# EasyEDA Pro project busmaster-v101.eprj, board bus-board
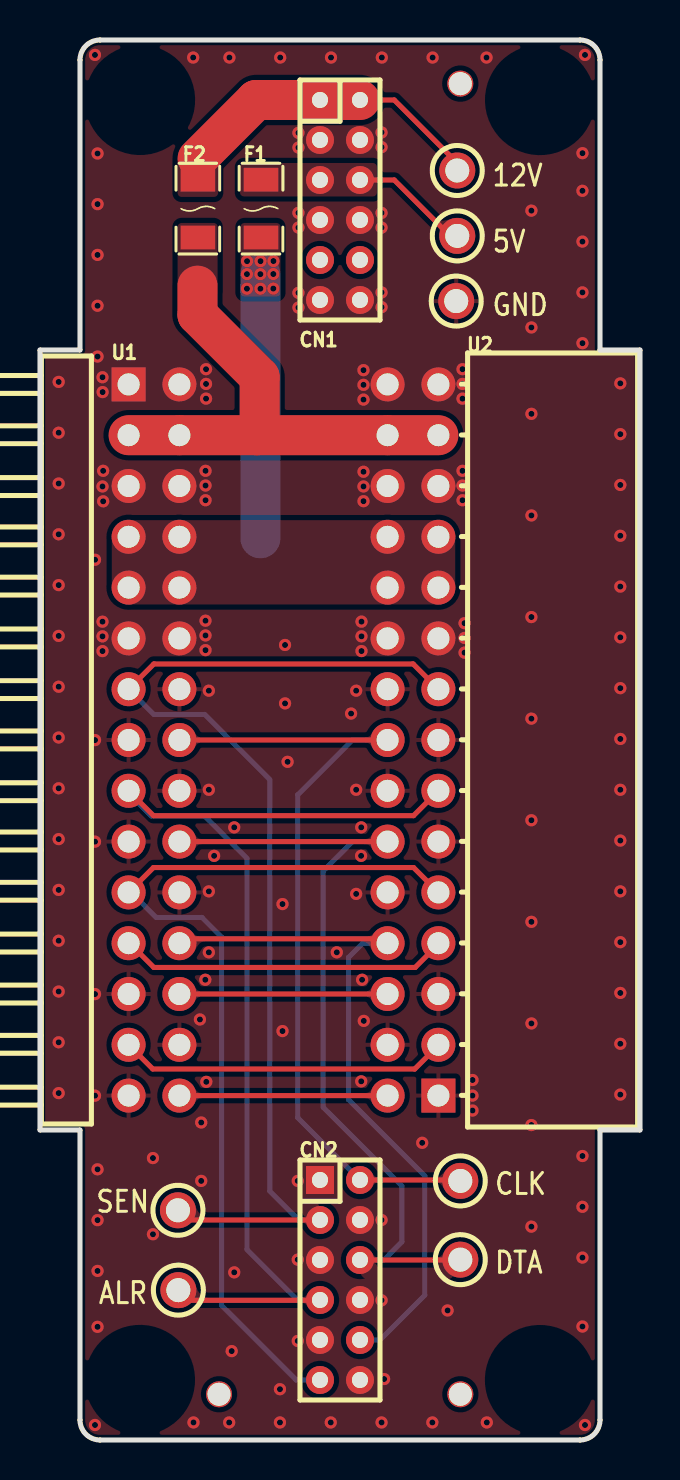
[diagram p8: board, top side]
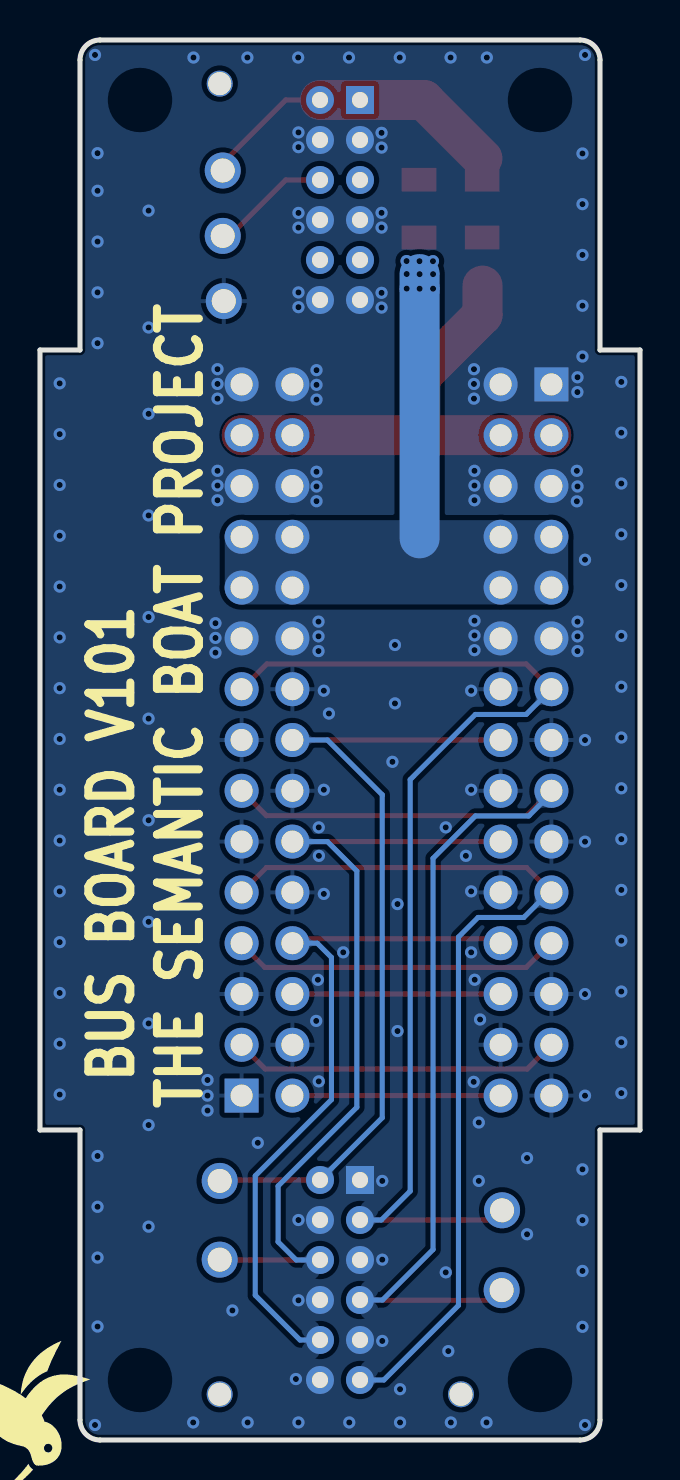
[diagram p9: board, bottom side, seen from below]

Outline 30 x 70 mm; copper layers: Top Layer, Inner1, Inner2, Bottom Layer. Coordinates in mm from the lower left corner of the outline.
Outline path: 0,54.5 2,54.5 2,69 arc(2.29,69.71) 3,70 27,70 arc(27.71,69.71) 28,69 28,54.5 30,54.5 30,15.5 28,15.5 28,1 arc(27.71,0.29) 27,0 3,0 arc(2.29,0.29) 2,1 2,15.5 0,15.5 0,54.5
Stack: Top Layer 0.035mm Outer layer thickness 1oz / Dielectric1 0.2104mm 7628 RC49% 8.6mil / Inner1 0.0152mm Inner layer thickness / Dielectric2 1.065mm 1.1mm H/HOZ Copper / Inner2 0.0152mm Inner layer thickness / Dielectric3 0.2104mm 7628 RC49% 8.6mil / Bottom Layer 0.035mm Outer layer thickness 1oz

## Design rules (mm)
net GND: power
net +5V: power
net +12V: power
template: JLCPCB Capability(Multiple Layers Board)
spacing copperThickness1oz (default): track to track 0.102, other pairs 0.152 to 0.3
spacing copperThickness2oz: track to track 0.203, other pairs 0.152 to 0.3
spacing copperThicknessInner0.5oz: track to track 0.089, other pairs 0.152 to 0.3
track width copperThickness1oz (default): min 0.102, default 0.254, max 2.54
track width copperThickness2oz: min 0.203, default 0.254, max 2.54
track width copperThickness0.5oz: min 0.089, default 0.254, max 2.54
differential pair differentialPair (default): width min 0.127, default 0.254, max 2.54; gap min 0.152, default 0.152
via viaSize (default): diameter min 0.3, default 0.61, max 10; hole min 0.2, default 0.305, max 6.3

## Placement (name value [footprint] x y rotation side)
CN1  PH2.0-01-06PZS  [HDR-TH_12P-P2.00-V-M-R2-C6-S2.00]  15 62 270 top
CN2  PH2.0-01-06PZS  [HDR-TH_12P-P2.00-V-M-R2-C6-S2.00]  15 8 270 top
F1  1206L100/30NR  [F1206]  11.05 61.57 270 top
F2  JK-nSMD050-30  [F1206]  7.89 61.57 270 top
NOREF  -  [Pad_e1]  8.95 2.29 0 top
NOREF#2  -  [Pad_e0]  21.02 2.29 0 top
NOREF#3  -  [Pad_e3]  21.01 67.82 0 top
TP0  RH-5004  [TESTPOINT_TH_BD2.5-D1.2]  20.81 56.95 90 top
TP1  RH-5004  [TESTPOINT_TH_BD2.5-D1.2]  20.86 63.47 0 top
TP2  RH-5004  [TESTPOINT_TH_BD2.5-D1.2]  20.86 60.2 0 top
TP4  RH-5004  [TESTPOINT_TH_BD2.5-D1.2]  21.01 12.95 0 top
TP5  RH-5004  [TESTPOINT_TH_BD2.5-D1.2]  21.01 9.02 0 top
TP6  RH-5004  [TESTPOINT_TH_BD2.5-D1.2]  6.92 7.49 0 top
TP7  RH-5004  [TESTPOINT_TH_BD2.5-D1.2]  6.9 11.49 0 top
U1  XDZ254-2-15-W-2.5-G1  [HDR-TH_30P-P2.54-H-M-R2-C15-S2.54-N]  5.7 35 270 top
U2  PM254-2-15-W-8.5  [HDR-TH_30P-P2.54-H-F-R2-C15-W8.5]  18.65 35 90 top

## Footprints (pads in the part's own frame, mm; a bottom-side part is the same pattern mirrored in y, then rotated)
F1206
  rect 1.19x1.728 smd: 1(-1.445,0) 2(1.445,0)
HDR-TH_12P-P2.00-V-M-R2-C6-S2.00
  rect 1.4x1.4 hole 0.8: 1(-5,-1)
  round 1.4 hole 0.8: 2(-5,1) 3(-3,-1) 4(-3,1) 5(-1,-1) 6(-1,1) 7(1,-1) 8(1,1) 9(3,-1) 10(3,1) 11(5,-1) 12(5,1)
HDR-TH_30P-P2.54-H-F-R2-C15-W8.5
  rect 1.7x1.7 hole 1.1: 1(-17.78,-1.27)
  round 1.7 hole 1.1: 2(-17.78,1.27) 3(-15.24,-1.27) 4(-15.24,1.27) 5(-12.7,-1.27) 6(-12.7,1.27) 7(-10.16,-1.27) 8(-10.16,1.27) 9(-7.62,-1.27) 10(-7.62,1.27) 11(-5.08,-1.27) 12(-5.08,1.27) 13(-2.54,-1.27) 14(-2.54,1.27) 15(0,-1.27) 16(0,1.27) 17(2.54,-1.27) 18(2.54,1.27) 19(5.08,-1.27) 20(5.08,1.27) 21(7.62,-1.27) 22(7.62,1.27) 23(10.16,-1.27) 24(10.16,1.27) 25(12.7,-1.27) 26(12.7,1.27) 27(15.24,-1.27) 28(15.24,1.27) 29(17.78,-1.27) 30(17.78,1.27)
HDR-TH_30P-P2.54-H-M-R2-C15-S2.54-N
  rect 1.7x1.7 hole 1.1: 1(-17.78,-1.27)
  round 1.7 hole 1.1: 2(-17.78,1.27) 3(-15.24,-1.27) 4(-15.24,1.27) 5(-12.7,-1.27) 6(-12.7,1.27) 7(-10.16,-1.27) 8(-10.16,1.27) 9(-7.62,-1.27) 10(-7.62,1.27) 11(-5.08,-1.27) 12(-5.08,1.27) 13(-2.54,-1.27) 14(-2.54,1.27) 15(0,-1.27) 16(0,1.27) 17(2.54,-1.27) 18(2.54,1.27) 19(5.08,-1.27) 20(5.08,1.27) 21(7.62,-1.27) 22(7.62,1.27) 23(10.16,-1.27) 24(10.16,1.27) 25(12.7,-1.27) 26(12.7,1.27) 27(15.24,-1.27) 28(15.24,1.27) 29(17.78,-1.27) 30(17.78,1.27)
Pad_e0
  round 1.3 hole 1.152: 1(0,0)
Pad_e1
  round 1.3 hole 1.152: 1(0,0)
Pad_e3
  round 1.3 hole 1.152: 1(0,0)
TESTPOINT_TH_BD2.5-D1.2
  round 1.8 hole 1.2: 1(0,0)

## Nets
As in the schematic.

Pads without a net: CN1 9 10; NOREF 1; NOREF#2 1; NOREF#3 1

## Via types
v1: diameter 0.61, hole 0.305, Top Layer to Bottom Layer, 180 vias

## Routing (per net, layer and track width the routed paths; a pad name or vN(x,y) marks a point on that pad's centre or on a via; arc(x,y) is an arc through that point)
+5V: length 13.2
  Bottom Layer w2: 11.02,45.08 v1(11.02,57.56) v1(11.02,58.29)
  vias: v1(10.35,58.29) v1(10.35,57.56) v1(10.35,58.94) v1(11.03,58.94) v1(11.67,58.95) v1(11.67,58.3) v1(11.67,57.57)
+12V: length 24.3
  Top Layer w2: 10.86,50.24 U1.4 U1.3 ; 10.86,50.24 10.98,50.36 10.98,53.15 7.87,56.26 7.87,57.72 ; 10.86,50.24 U2.28 U2.27
GND:
  vias: v1(0.93,52.9) v1(0.93,50.36) v1(0.93,47.82) v1(0.93,45.28) v1(0.93,42.74) v1(0.93,40.2) v1(0.93,37.66) v1(0.93,35.12) v1(0.93,32.58) v1(0.93,30.04) v1(0.93,27.5) v1(0.93,24.96) v1(0.93,22.42) v1(0.93,19.88) v1(0.93,17.34) v1(2.75,69.25) v1(2.75,0.75) v1(2.75,44.01) v1(2.75,35) v1(2.75,29.92) v1(2.75,22.3) v1(2.75,17.22) v1(2.88,64.33) v1(2.88,61.79) v1(2.88,59.25) v1(2.88,56.71) v1(2.88,54.17) v1(2.88,13.53) v1(2.88,10.99) v1(2.88,8.45) v1(2.88,5.66) v1(3.12,53.14) v1(3.13,52.4) v1(3.12,47.68) v1(3.12,40.92) v1(3.12,40.18) v1(3.12,39.44) v1(3.16,48.46) v1(3.16,46.93) v1(5.65,14.1) v1(5.65,10.29) v1(7.66,69.12) v1(7.67,0.88) v1(8,21.03) v1(8.06,15.88) v1(8.06,12.95) v1(8.3,53.54) v1(8.3,52.8) v1(8.3,52.07) v1(8.28,48.46) v1(8.28,47.72) v1(8.28,46.99) v1(8.28,40.97) v1(8.28,40.23) v1(8.28,39.49) v1(8.26,23.01) v1(8.31,17.91) v1(8.44,37.47) v1(8.44,32.51) v1(8.44,27.43) v1(8.44,24.38) v1(8.71,29.21) v1(9.47,69.12) v1(9.46,0.88) v1(9.59,4.44) v1(9.71,30.63) v1(9.71,8.38) v1(12.01,69.12) v1(12,2.54) v1(12,0.88) v1(12.12,26.8) v1(12.12,20.45) v1(12.25,39.75) v1(12.25,36.83) v1(12.38,33.91) v1(12.92,65.36) v1(12.92,64.62) v1(12.92,61.36) v1(12.92,60.62) v1(12.92,57.36) v1(12.92,56.62) v1(12.89,12.95) v1(12.89,9.02) v1(12.89,4.95) v1(14.54,0.88) v1(14.55,69.12) v1(14.84,24.38) v1(15.55,36.32) v1(15.81,37.47) v1(15.81,32.51) v1(15.81,27.31) v1(16.07,40.92) v1(16.07,40.18) v1(16.07,39.45) v1(16.06,30.63) v1(16.06,29.21) v1(16.1,23.01) v1(16.06,17.93) v1(16.18,53.49) v1(16.18,52.76) v1(16.18,52.02) v1(16.18,48.41) v1(16.18,47.68) v1(16.18,46.94) v1(16.19,20.95) v1(17.09,69.12) v1(17.08,65.38) v1(17.08,64.64) v1(17.08,61.35) v1(17.08,60.62) v1(17.08,57.38) v1(17.08,56.64) v1(17.08,11) v1(17.08,6.99) v1(17.08,0.88) v1(17.21,3.05) v1(19.11,14.86) v1(19.63,69.12) v1(19.62,0.88) v1(20.38,6.48) v1(21.12,53.54) v1(21.12,52.8) v1(21.12,52.07) v1(21.12,48.46) v1(21.12,47.72) v1(21.12,46.99) v1(21.23,40.84) v1(21.23,40.1) v1(21.23,39.37) v1(21.62,18) v1(21.62,17.22) v1(21.62,16.47) v1(22.33,69.12) v1(22.34,0.88) v1(24.57,61.47) v1(24.57,55.63) v1(24.57,51.31) v1(24.57,46.23) v1(24.57,41.15) v1(24.57,36.07) v1(24.57,30.99) v1(24.57,25.91) v1(24.57,20.83) v1(24.57,15.75) v1(24.57,10.67) v1(27.12,64.34) v1(27.12,62.46) v1(27.12,59.92) v1(27.12,57.38) v1(27.12,54.84) v1(27.12,14.2) v1(27.12,11.66) v1(27.12,9.12) v1(27.12,5.67) v1(27.25,69.25) v1(27.25,0.75) v1(29.02,52.83) v1(29.02,50.29) v1(29.02,47.75) v1(29.02,45.21) v1(29.02,42.67) v1(29.02,40.13) v1(29.02,37.59) v1(29.02,35.05) v1(29.02,32.51) v1(29.02,29.97) v1(29.02,27.43) v1(29.02,24.89) v1(29.02,22.35) v1(29.02,19.81) v1(29.02,17.27)
SB_RES0: length 35.5
  Top Layer w0.254: U2.8 17.16,25.06 7.19,25.06 U1.24
  Bottom Layer w0.254: U2.8 16.14,24.84 15.43,24.13 15.43,17.02 19.24,13.21 19.24,7.24 17,5 CN2.10
SB_RES1: length 47
  Top Layer w0.254: U1.21 5.67,28.62 18.68,28.62 U2.9
  Bottom Layer w0.254: U1.21 4.56,27.38 5.81,26.13 8.1,26.13 9.08,25.15 9.08,6.73 12.81,3 CN2.11
SB_RES2: length 10.4
  Top Layer w0.254: U1.26 U2.6
SB_RES3: length 16.5
  Top Layer w0.254: U1.23 4.48,24.84 5.69,23.63 18.76,23.63 19.92,24.79 U2.7
SB_RES4: length 10.4
  Top Layer w0.254: U1.30 U2.2
SB_RES5: length 16.5
  Top Layer w0.254: U2.3 19.92,19.73 18.74,18.55 5.64,18.55 U1.27
SMBUS_ALERT: length 55.5
  Top Layer w0.254: CN2.7 13.99,6.99 7.43,6.99 TP6.1 ; U2.13 18.68,31.22 5.67,31.22 U1.17
  Bottom Layer w0.254: U1.17 4.43,32.33 5.56,31.2 8.23,31.2 10.35,29.08 10.35,9.53 12.87,7 CN2.7
SMBUS_CLK: length 41.9
  Top Layer w0.254: U1.16 U2.16 ; TP4.1 20.97,13 15.75,13
  Bottom Layer w0.254: CN2.2 12.89,16.11 12.89,32.26 15.63,35 U2.16
SMBUS_DATA: length 41.9
  Top Layer w0.254: TP5.1 21,9 CN2.6 ; U1.20 U2.12
  Bottom Layer w0.254: CN2.6 17.19,9 18.09,9.91 18.09,12.7 14.16,16.64 14.16,28.45 15.63,29.92 U2.12
STACK_ENABLED: length 56.5
  Top Layer w0.254: U2.17 18.66,38.8 5.69,38.8 U1.13 ; CN2.3 7.35,11 6.9,11.45 TP7.1
  Bottom Layer w0.254: U1.13 5.69,36.28 8.23,36.28 11.49,33.02 11.49,12.45 12.94,11 CN2.3
$1N3146: length 15.9
  Top Layer w0.254: CN1.2 17.71,67 20.86,63.85 TP1.1
  Top Layer w2: 7.88,64.08 10.8,67 CN1.1 CN1.2
$1N3154: length 6
  Top Layer w0.254: CN1.6 17.71,63 20.51,60.2 TP2.1

## Copper pours and planes (outline as drawn; the poured copper is in the pictures)
+5V on Top Layer: 10.02,60.85 12.02,60.85 12.02,57.18 10.02,57.18
+5V on Top Layer: 3.59,45.99 20.76,45.99 20.76,41.78 3.59,41.78
+5V on Bottom Layer: 3.59,45.99 20.76,45.99 20.76,41.78 3.59,41.78
+12V on Top Layer: 6.88,60.85 8.88,60.85 8.88,57.18 6.88,57.18
GND on Top Layer: -1.08,70.23 30.92,70.23 30.92,-0.38 -1.08,-0.38
GND on Bottom Layer: -0.83,70.36 30.79,70.36 30.79,-0.38 -0.83,-0.38
GND on Inner1: -1.34,73.03 30.54,73.03 30.54,-2.16 -1.34,-2.16
GND on Inner2: -4.13,73.28 34.86,73.28 34.86,-4.95 -4.13,-4.95
$1N3146 on Top Layer: 6.88,64.26 8.91,64.26 8.91,62.15 6.88,62.15
$1N3154 on Top Layer: 10,63.85 16.85,63.85 16.85,62.18 10,62.18

Small or netless copper shapes (teardrops, artwork), in the pictures only: 20 on Top Layer, 12 on Bottom Layer

## Text on the board
Bottom Silkscreen Layer: THE SEMANTIC BOAT PROJECT | BUS BOARD V101
Top Silkscreen Layer: SEN | ALR | 12V | 5V | GND | CLK | DTA
